# Altium schematic sheet S5 - BLUETOOTH.SchDoc: BLUETOOTH MODULE
size A; FIELD_1: 1; FIELD_2: 2; FIELD_3: 3; FIELD_4: 4; FIELD_5: 5; FIELD_6: 6; FIELD_7: 7; FIELD_8: 8; Engineer: M. TALEBI; Organization: MACHINE INTELLIGENCE LAB; Revision: 0; Project: BLUETOOTH SYSTEM STATUS BOARD
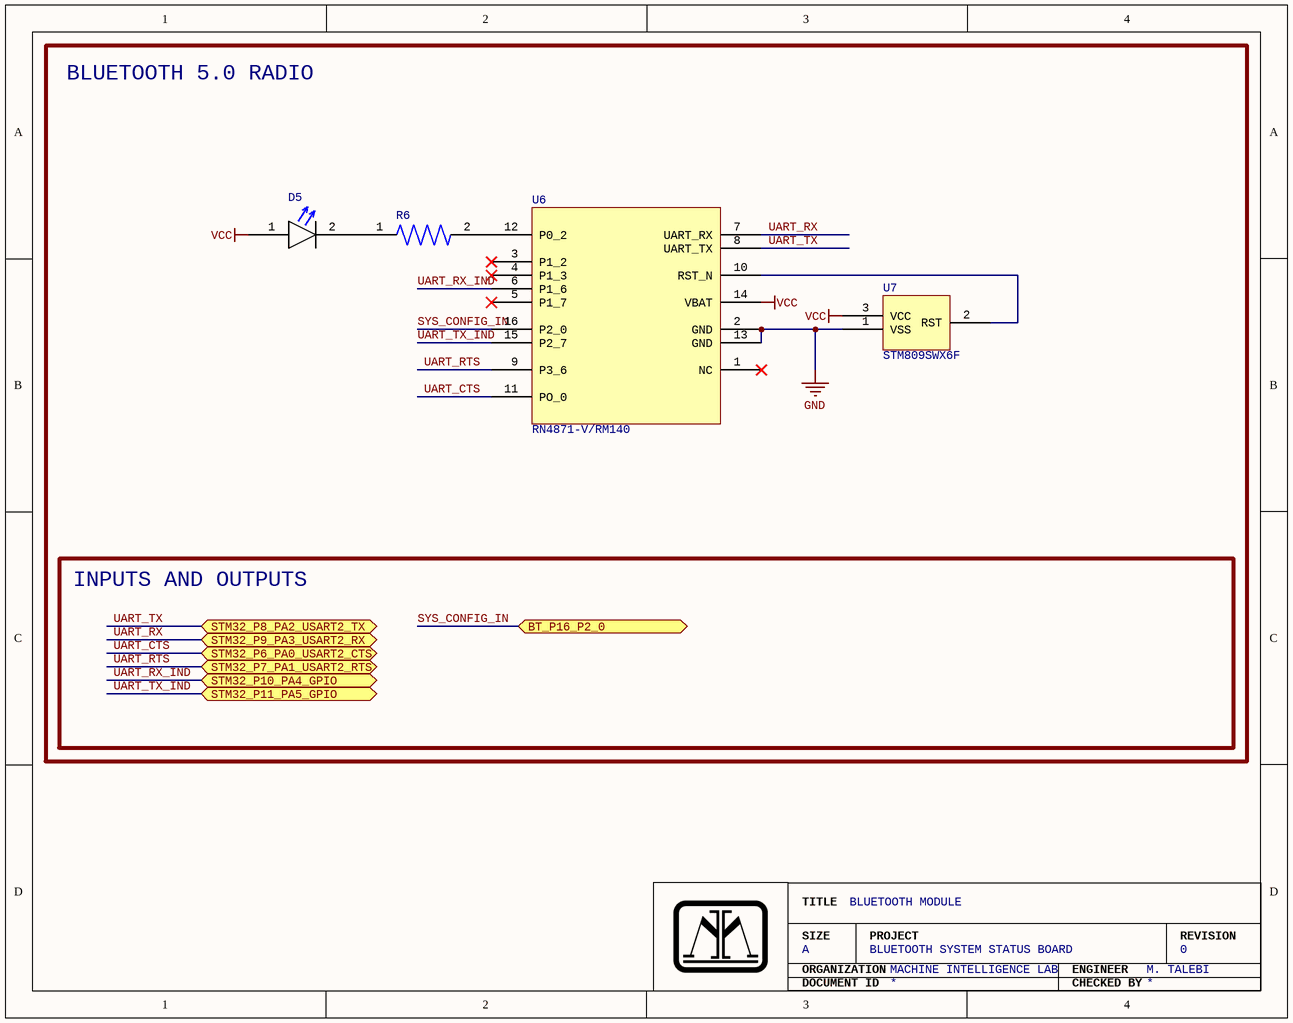
[diagram p0: S5 - BLUETOOTH.SchDoc]

## Parts
D5  SLR343BC4T3F  [SLR343BC4T3F]  (value not drawn)
R6  CRCW0201330RFKED  [CRCW0201330RFKED]  (value not drawn)
U6  RN4871-V/RM140  [RN4871-V/RM140]
U7  STM809SWX6F  [STM809SWX6F]

## Ports
BT_P16_P2_0 (bidir), STM32_P6_PA0_USART2_CTS (bidir), STM32_P7_PA1_USART2_RTS (bidir), STM32_P8_PA2_USART2_TX (bidir), STM32_P9_PA3_USART2_RX (bidir), STM32_P10_PA4_GPIO (bidir), STM32_P11_PA5_GPIO (bidir)

## Nets
GND: U6.2(GND) U6.13(GND) U7.1(VSS)
VCC: D5.1(-) U6.14(VBAT) U7.3(VCC)
SYS_CONFIG_IN: U6.16(P2_0) ; port BT_P16_P2_0
UART_CTS: U6.11(PO_0) ; port STM32_P6_PA0_USART2_CTS
UART_RTS: U6.9(P3_6) ; port STM32_P7_PA1_USART2_RTS
UART_RX: U6.7(UART_RX) ; port STM32_P9_PA3_USART2_RX
UART_RX_IND: U6.6(P1_6) ; port STM32_P10_PA4_GPIO
UART_TX: U6.8(UART_TX) ; port STM32_P8_PA2_USART2_TX
UART_TX_IND: U6.15(P2_7) ; port STM32_P11_PA5_GPIO
NetD5_2: D5.2(+) R6.1
NetR6_2: R6.2 U6.12(P0_2)
NetU6_10: U6.10(RST_N) U7.2(RST)

Not connected (* = marked no-connect by the designer): U6 1(NC)* 3(P1_2)* 4(P1_3)* 5(P1_7)*

## Notes on the sheet
- BLUETOOTH 5.0 RADIO
- INPUTS AND OUTPUTS
- TITLE
- SIZE
- ORGANIZATION
- A
- PROJECT
- ENGINEER
- REVISION
- DOCUMENT ID
- CHECKED BY

## Library data of the parts
D5 = SLR343BC4T3F: LED BLUE CLEAR T-1 T/H; Configuration: Standard; Lens Color: Colorless; Millicandela Rating: 470mcd; Lens Style: Round with Domed Top; Lens Size: 3.10mm Dia; Voltage - Forward (Vf) (Typ): 3.2V; Current - Test: 20mA; Viewing Angle: 40°; Wavelength - Dominant: 470nm; Color: Blue; Lens Transparency: Clear; Mounting Type: Through Hole; Package / Case: Radial; Supplier Device Package: T-1; Height (Max): 5.60mm; Supplier 1: Digi-Key; Supplier Part Number 1: 846-1137-ND
R6 = CRCW0201330RFKED: RES SMD 330 OHM 1% 1/20W 0201; Power (Watts): 0.05W, 1/20W; Temperature Coefficient: ±100ppm/°C; Resistance: 330 Ohms; Tolerance: ±1%; Composition: Thick Film; Operating Temperature: -55°C ~ 155°C; Package / Case: 0201 (0603 Metric); Supplier Device Package: 0201; Size / Dimension: 0.024" L x 0.012" W (0.60mm x 0.30mm); Height - Seated (Max): 0.011" (0.28mm); Number of Terminations: 2; ComponentLink1Description: Datasheet; ComponentLink1URL: https://www.vishay.com/docs/20052/crcw0201e3.pdf
U6 = RN4871-V/RM140: RX TXRX MODULE BLE CHIP SMD; Utilized IC / Part: RN4871; RF Family/Standard: Bluetooth; Protocol: Bluetooth v5.0; Modulation: GFSK; Frequency: 2.402GHz ~ 2.48GHz; Data Rate: 10kbps; Power - Output: 0dBm; Sensitivity: -90dBm; Serial Interfaces: I²C, AIO, PIO, PWM, SPI, UART; Antenna Type: Integrated, Chip; Voltage - Supply: 1.9V ~ 3.6V; Current - Receiving: 13mA; Current - Transmitting: 13mA; Mounting Type: Surface Mount; Operating Temperature: -20°C ~ 70°C; Package / Case: 16-SMD Module; Supplier 1: Newark; Supplier Part Number 1: 39AH3381; ComponentLink1Description: Datasheet; ComponentLink1URL: https://ww1.microchip.com/downloads/en/DeviceDoc/RN4870-71-Data-Sheet-DS50002489E.pdf
U7 = STM809SWX6F: IC SUPERVISOR 1 CHANNEL SOT23-3; Voltage - Threshold: 2.93V; Output: Push-Pull, Totem Pole; Reset: Active Low; Reset Timeout: 140ms Minimum; Number of Voltages Monitored: 1; Type: Simple Reset/Power-On Reset; Operating Temperature: -40°C ~ 85°C (TA); Mounting Type: Surface Mount; Package / Case: TO-236-3, SC-59, SOT-23-3; Supplier Device Package: SOT-23-3; ComponentLink1Description: Datasheet; ComponentLink1URL: https://www.st.com/content/ccc/resource/technical/document/datasheet/cd/e2/ab/27/7d/5d/44/41/CD00003591.pdf/files/CD00003591.pdf/jcr:content/translations/en.CD00003591.pdf; Supplier 1: Digi-Key; Supplier Part Number 1: 497-3338-1-ND